# Altium schematic sheet Archimedes_Surucu_Cift_Cikis.SchDoc: Archimedes_Surucu_Cift_Cikis_Tasarımı
size A4; SheetNumber: 8; SheetTotal: 8; Sematikicerigi: Step Motor Sürücü Katı Tasarımı(Çift Çıkış)
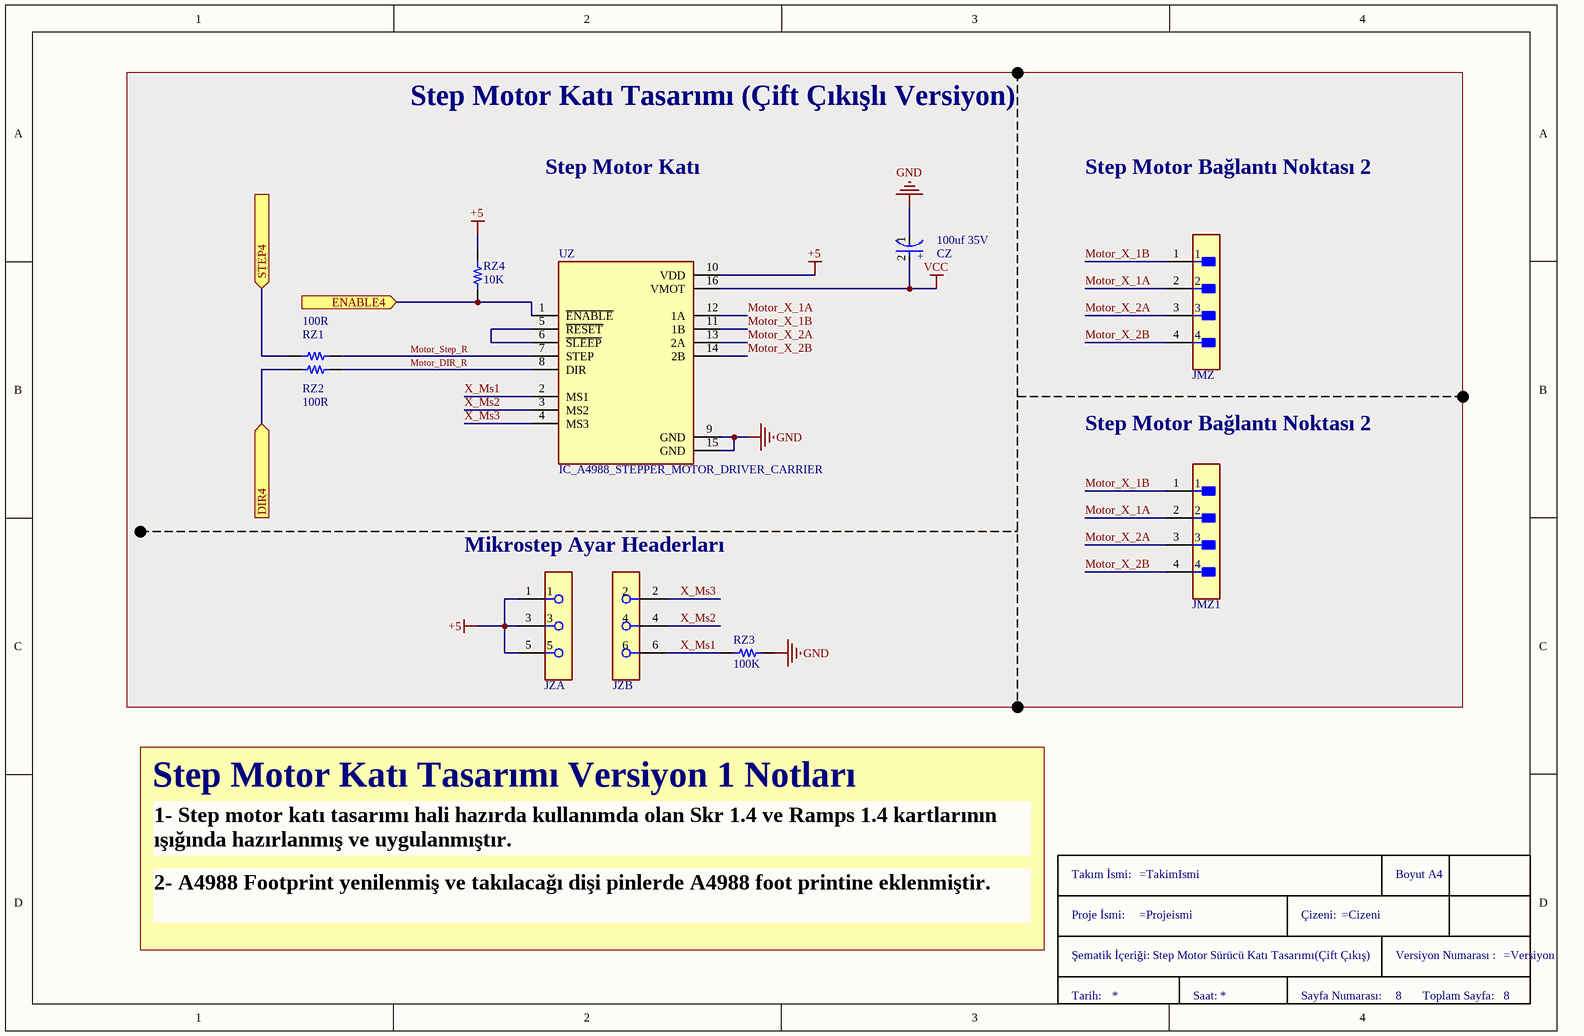
[diagram p0: Archimedes_Surucu_Cift_Cikis.SchDoc]

## Parts
CZ  100uf 35V  [C_Smd_D6.3_H_7.7_Electrolytic_Cap]
JMZ  2.5 mm locked  [CON_2.5MM_4_LEAD_180_LOCKED]  (value not drawn)
JMZ1  2.5 mm locked  [CON_2.5MM_4_LEAD_180_LOCKED]  (value not drawn)
JZ  Con_3*2_Male_Header  [Con_3*2_Male_header]  (value not drawn)  (parts A,B of 2)
RZ1  100R  [RES 0805/2012]
RZ2  100R  [RES 0805/2012]
RZ3  100K  [RES 0805/2012]
RZ4  10K  [RES 0805/2012]
TitleBlock-A4  TitleBlock-A4  (value not drawn)  (graphical)
UZ  IC_A4988_STEPPER_MOTOR_DRIVER_CARRIER  [IC_A4988_STEPPER_MOTOR_DRIVER_CARRIER]

## Blocks framed on the sheet
Step Motor Katı Tasarımı (Çift Çıkışlı Versiyon): CZ JMZ JMZ1 JZ RZ1-RZ4 UZ

## Ports
DIR4 (in), ENABLE4 (in), STEP4 (in)

## Nets
+5: JZ.1 JZ.3 JZ.5 RZ4.2 UZ.10(VDD)
GND: CZ.1(C) RZ3.2 UZ.9(GND) UZ.15(GND)
VCC: CZ.2(A) UZ.16(VMOT)
DIR4: RZ2.1 ; port DIR4
ENABLE4: RZ4.1 UZ.1(~{ENABLE}) ; port ENABLE4
Motor_DIR_R: RZ2.2 UZ.8(DIR)
Motor_Step_R: RZ1.2 UZ.7(STEP)
Motor_X_1A: JMZ.2 JMZ1.2 UZ.12(1A)
Motor_X_1B: JMZ.1 JMZ1.1 UZ.11(1B)
Motor_X_2A: JMZ.3 JMZ1.3 UZ.13(2A)
Motor_X_2B: JMZ.4 JMZ1.4 UZ.14(2B)
STEP4: RZ1.1 ; port STEP4
X_Ms1: JZ.6 RZ3.1 UZ.2(MS1)
X_Ms2: JZ.4 UZ.3(MS2)
X_Ms3: JZ.2 UZ.4(MS3)
NetUZ_5: UZ.5(~{RESET}) UZ.6(~{SLEEP})

## Notes on the sheet
- Step Motor Katı
- Step Motor Bağlantı Noktası 2
- (near JZ) Mikrostep Ayar Headerları
- Step Motor Katı Tasarımı Versiyon 1 Notları
- 1- Step motor katı tasarımı hali hazırda kullanımda olan Skr 1.4 ve Ramps 1.4 kartlarının ışığında hazırlanmış ve uygulanmıştır.
- 2- A4988 Footprint yenilenmiş ve takılacağı dişi pinlerde A4988 foot printine eklenmiştir.
- (in symbol C_smd_D6.3_H7.7) +
- (in symbol TitleBlock-A4) Takım İsmi:; Boyut A4; Proje İsmi:; Çizeni:; Şematik İçeriği:; Versiyon Numarası :; Tarih:; Saat:; Sayfa Numarası:; Toplam Sayfa:

## Library data of the parts
CZ = C_smd_D6.3_H7.7: electrolytic capacitor with 100 uf and 35 volt rating
JMZ JMZ1 = Con_2.5mm_4_lead_180_locked: 2.5 mm 4 lead locked connector
JZ = Con_3*2_Male_Header: 3*2 male header
RZ1 RZ2 = Resistor 805: 100 R ohm Resistor  with 805 pack and %1 tolerance rating
RZ3 = Resistor 805: 100 K ohm Resistor  with 805 pack and %1 tolerance rating
RZ4 = Resistor 805: 10 K ohm Resistor  with 805 pack and %1 tolerance rating
TitleBlock-A4 = TitleBlock-A4: Title Block for İTU eklemeli imalat takımı
UZ = IC_A4988_STEPPER_MOTOR_DRIVER_CARRIER: Stepper motor controler; IC: A4988; 1A; Uin mot: 8Ã·35V; Package: None; Availability: Unavailable; Value: *; MP: A4988_STEPPER_MOTOR_DRIVER_CARRIER; Price: None